# Altium schematic sheet Schematic.SchDoc
size A; SheetNumber: 1; SheetTotal: 1
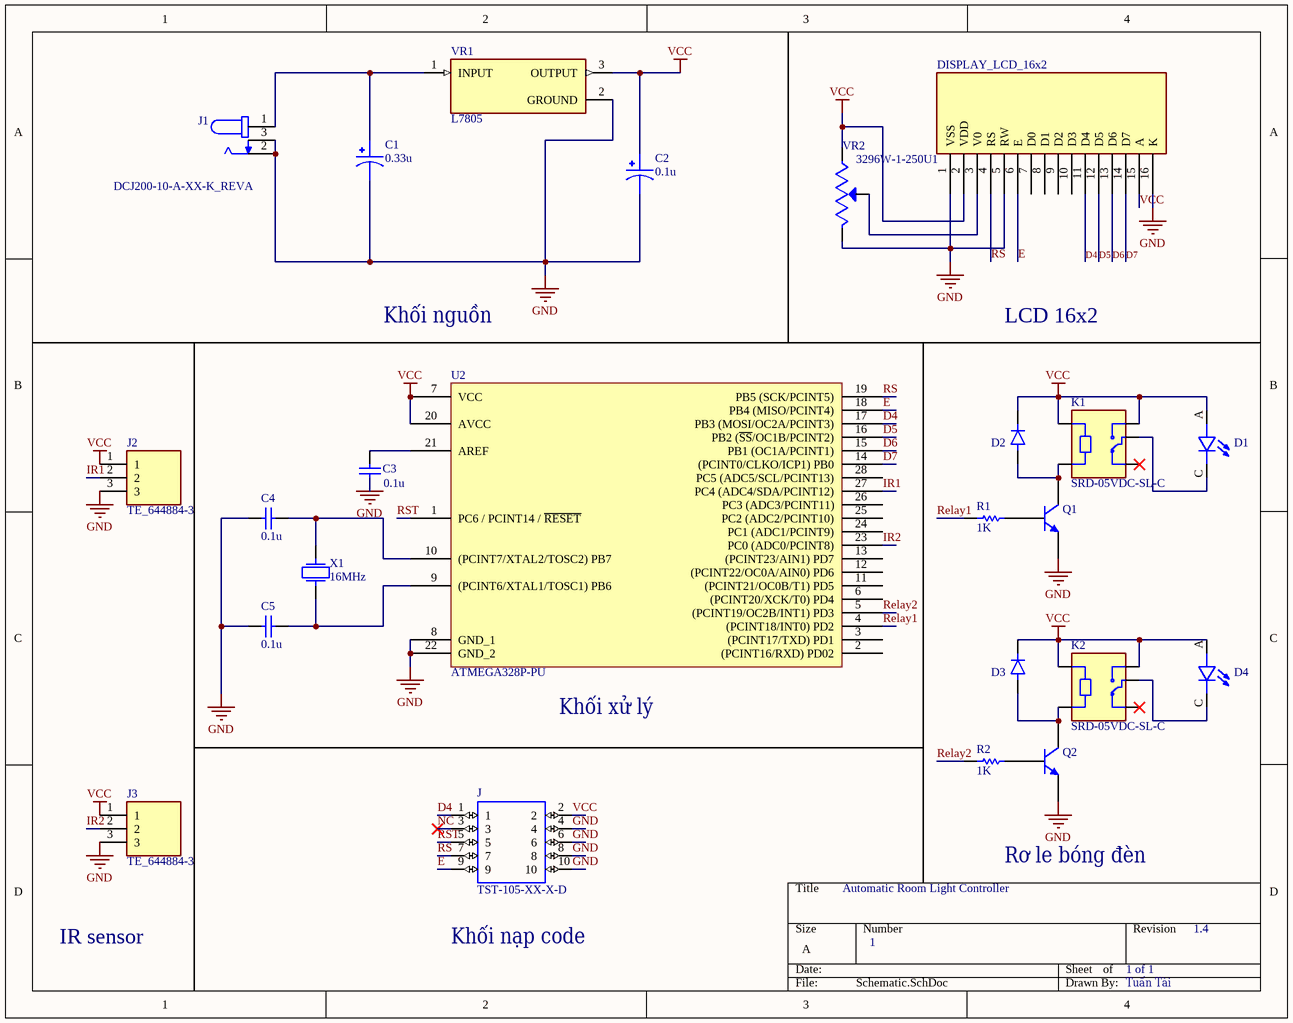
[diagram p0: Schematic.SchDoc]

## Parts
C1  0.33u  [CAPPRD500W60D1330H2700]
C2  0.1u  [CAPPRD500W60D1330H2700]
C3  value 0.1u  [CAPPRD500W60D1330H2700]  (hidden comment: Capacitor)
C4  value 0.1u  [CAPPRD500W60D1330H2700]  (hidden comment: Capacitor)
C5  value 0.1u  [CAPPRD500W60D1330H2700]  (hidden comment: Capacitor)
D1  L08R5000Q1  [LEDRD254W57D500H1070]  (value not drawn)
D2  1N4007-T  [DIOAD780W78L463D236]  (value not drawn)
D3  1N4007-T  [DIOAD780W78L463D236]  (value not drawn)
D4  L08R5000Q1  [LEDRD254W57D500H1070]  (value not drawn)
J  TST-105-XX-X-D  [TST-105-XX-X-D]
J1  DCJ200-10-A-XX-K_REVA  [GCT_DCJ200-10-A-XX-K_REVA]
J2  TE_644884-3  [TE_644884-3]
J3  TE_644884-3  [TE_644884-3]
K1  SRD-05VDC-SL-C  [RELAY_SRD-05VDC-SL-C]
K2  SRD-05VDC-SL-C  [RELAY_SRD-05VDC-SL-C]
Q1  Bipolar NPN 3 Pins Transistor VBIC Model  [TO92]  (value not drawn)
Q2  Bipolar NPN 3 Pins Transistor VBIC Model  [TO92]  (value not drawn)
R1  value 1K  [RESAD1100W55L680D260]  (hidden comment: Resistor)
R2  value 1K  [RESAD1100W55L680D260]  (hidden comment: Resistor)
U1  DISPLAY_LCD_16x2  [DISPLAY_LCD_16_2]
U2  ATMEGA328P-PU  [27_DIP_7.62mm]
VR1  L7805  [TO255P1020X450X2000-3]
VR2  3296W-1-250  [TRIM_3296W-1-250]
X1  F0: 16MHz  [XTAL_HC49P488W46L1150T500H350]  (hidden comment: Crystal)

## Nets
GND: C1.2 C2.2 C3.1 C4.1 C5.1 J.4 J.6 J.8 J.10 J1.2 J1.3 J2.3 J3.3 Q1.3(E) Q2.3(E) U1.1(VSS) U1.5(RW) U1.16(K) U2.8(GND_1) U2.22(GND_2) VR1.2(GROUND) VR2.3(CW)
VCC: C2.1 D1.A D2.K D3.K D4.A J.2 J2.1 J3.1 K1.A1 K1.NO K2.A1 K2.NO U1.2(VDD) U1.15(A) U2.7(VCC) U2.20(AVCC) VR1.3(OUTPUT) VR2.1(CCW)
D4: J.1 U1.11(D4) U2.17(PB3_(MOSI/OC2A/PCINT3))
D5: U1.12(D5) U2.16(PB2_(~{SS}/OC1B/PCINT2))
D6: U1.13(D6) U2.15(PB1_(OC1A/PCINT1))
D7: U1.14(D7) U2.14((PCINT0/CLKO/ICP1)_PB0)
E: J.9 U1.6(E) U2.18(PB4_(MISO/PCINT4))
IR1: J2.2 U2.27(PC4_(ADC4/SDA/PCINT12))
IR2: J3.2 U2.23(PC0_(ADC0/PCINT8))
NC: J.3
Relay1: R1.1 U2.4((PCINT18/INT0)_PD2)
Relay2: R2.1 U2.5((PCINT19/OC2B/INT1)_PD3)
RS: J.7 U1.4(RS) U2.19(PB5_(SCK/PCINT5))
RST: J.5 U2.1(PC6_/_PCINT14_/_~{RESET})
NetC1_1: C1.1 J1.1 VR1.1(INPUT)
NetC3_2: C3.2 U2.21(AREF)
NetC4_2: C4.2 U2.10((PCINT7/XTAL2/TOSC2)_PB7) X1.2
NetC5_2: C5.2 U2.9((PCINT6/XTAL1/TOSC1)_PB6) X1.1
NetD1_C: D1.C K1.COM
NetD2_A: D2.A K1.A2 Q1.1(C)
NetD3_A: D3.A K2.A2 Q2.1(C)
NetD4_C: D4.C K2.COM
NetQ1_2: Q1.2(B) R1.2
NetQ2_2: Q2.2(B) R2.2
NetU1_3: U1.3(V0) VR2.2(WIPER)

Not connected (* = marked no-connect by the designer): K1 NC*; K2 NC*; U1 7(D0) 8(D1) 9(D2) 10(D3); U2 2((PCINT16/RXD)_PD02) 3((PCINT17/TXD)_PD1) 6((PCINT20/XCK/T0)_PD4) 11((PCINT21/OC0B/T1)_PD5) 12((PCINT22/OC0A/AIN0)_PD6) 13((PCINT23/AIN1)_PD7) 24(PC1_(ADC1/PCINT9)) 25(PC2_(ADC2/PCINT10)) 26(PC3_(ADC3/PCINT11)) 28(PC5_(ADC5/SCL/PCINT13))

## Notes on the sheet
- Khối nguồn
- LCD 16x2
- (near U2) Khối xử lý
- Automatic Room Light Controller
- Rơ le bóng đèn
- IR sensor
- Khối nạp code
- 1
- 1 of 1
- 1.4
- Tuấn Tài

## Library data of the parts
C1 C2 = 478CKS010M: 4700ÂµF 10V Aluminum Electrolytic Capacitors Radial, Can 98.8mOhm @ 120Hz 2000 Hrs @ 85Â°C; MF: Illinois Capacitor; MP: 478CKS010M; SnapEDA_Link: https://www.snapeda.com/parts/478CKS010M/Illinois%20Capacitor/view-part/2347563/?ref=snap; Price: None; Mouser-Purchase-URL: https://snapeda.com/shop?store=Mouser&id=2347563; Availability: Warning; Package: Radial Illinois Capacitor; Value: *
C3-C5 = Capacitor: SimulationGenericComponent: True
D1 D4 = L08R5000Q1: LED, 5MM, ORANGE; LED / Lamp Size: 5mm / T-1 3/4; LED Colour: Orange; Typ Luminous Intensity: 4.3mcd; Viewing Angle: ...; MF: LED Technology; Value: *; SnapEDA_Link: https://www.snapeda.com/parts/L08R5000Q1/LED+Technology/view-part/?ref=snap; MP: L08R5000Q1; Check_prices: https://www.snapeda.com/parts/L08R5000Q1/LED+Technology/view-part/?ref=eda; Availability: In Stock; Price: None; Package: None
D2 D3 = 1N4007-T: Diode Standard 1A 1000V 1Vf DO41 | Diodes Inc 1N4007-T; MF: Diodes Incorporated; SnapEDA_Link: https://www.snapeda.com/parts/1N4007-T/Diodes+Inc./view-part/?ref=snap; Package: DO-41 Diodes Inc.; Value: *; MP: 1N4007-T; Check_prices: https://www.snapeda.com/parts/1N4007-T/Diodes+Inc./view-part/?ref=eda
J = TST-105-XX-X-D: Connector Header Through Hole 10 position 0.100 _2.54mm_; MF: Samtec; MP: TST-105-02-F-D; Value: *; SnapEDA_Link: https://www.snapeda.com/parts/TST-105-02-F-D/Samtec%20Inc./view-part/787167/?ref=snap; Package: None; Price: None; Availability: Unavailable
J1 = DCJ200-10-A-XX-K_REVA: Power Barrel Connector Jack 2.05mm ID (0.081), 5.50mm OD (0.217) Through Hole, Right Angle; MF: Global Connector Technology; MP: DCJ200-10-A-K1-K; SnapEDA_Link: https://www.snapeda.com/parts/DCJ200-10-A-K1-K/Global+Connector+Technology/view-part/?ref=snap; Package: None; Value: *; Check_prices: https://www.snapeda.com/parts/DCJ200-10-A-K1-K/Global+Connector+Technology/view-part/?ref=eda
J2 J3 = 644884-3: Package: None; Price: None; Value: *; MP: 644884-3; Availability: Unavailable
K1 K2 = SRD-05VDC-SL-C: 5V Trigger Relay Module For Arduino And Raspberry Pi 5V Trigger Relay Module For Arduino And Raspberry Pi; MF: Songle Relay; Check_prices: https://www.snapeda.com/parts/SRD-05VDC-SL-C/Songle+Relay/view-part/?ref=eda; Value: *; Availability: Not in stock; Price: None; Package: NON STANDARD-5 Songle Relay; MP: SRD-05VDC-SL-C; SnapEDA_Link: https://www.snapeda.com/parts/SRD-05VDC-SL-C/Songle+Relay/view-part/?ref=snap
Q1 Q2 = BJT NPN VBIC: SimulationGenericComponent: True; AFN: 1; AJC: -0.5; ART: 0.1; AVC1: 0; EA: 1.12; FC: 0.9; IBBE: 1e-06; IBCI: 1e-16; IBEI: 1e-18; MC: 0.33; NCN: 2; NKF: 0.5; PC: 0.75; TNOM: 27; VERS: 1.2; XII: 3; AJE: -0.5; AJS: -0.5; AVC2: 0; BFN: 1; CBCO: 0; CBEO: 0; CCSO: 0; CJC: 0; CJCP: 0; CJE: 0; CJEP: 0; CTH: 0; DEAR: 0; EAIC: 1.12; EAIE: 1.12; EAIS: 1.12; EANC: 1.12; EANE: 1.12; EANS: 1.12; EAP: 1.12; EBBE: 0; GAMM: 0; HRCF: 1; IBCIP: 0; IBCN: 0; IBCNP: 0; IBEIP: 0; IBEN: 0; IBENP: 0; IKF: 0; IKP: 0; IKR: 0; IS: 1e-16; ISP: 0; ISRR: 1; ITF: 0; KFN: 0; ME: 0.33; MS: 0.33; NBBE: 1; NCI: 1; NCIP: 1; NCNP: 2; NEI: 1; NEN: 2; NF: 1; NFP: 1; NR: 1; PE: 0.75; PS: 0.75; QBM: 0; QCO: 0; QTF: 0; RBI: 0.1; RBP: 0.1; RBX: 0; RCI: 0.1; RCX: 0; RE: 0; RS: 0; RTH: 0; TAVC: 0; TD: 0; TF: 0; TNBBE: 0; TNF: 0; TR: 0; TVBBE1: 0; TVBBE2: 0; VBBE: 0; VEF: 0; VER: 0; VO: 0; VREF: 0; VRT: 0; VTF: 0; WBE: 1; WSP: 1; XIKF: 0; XIN: 3; XIS: 3; XISR: 0; XRBI: 0; XRBP: 0; XRBX: 0; XRCI: 0; XRCX: 0; XRE: 0; XRS: 0; XTF: 0; XVO: 0
R1 R2 = Resistor: TC1: 0; SimulationGenericComponent: True; TC2: 0
U1 = DISPLAY_LCD_16_2: Display LCD 16x2 I2C.
U2 = ATMEGA328P-PU: ATMEGA328P-PU; 8 bit Microcontroller AVR 20MHz 1; 32kb Flash; 2kb RAM; I2C SPI 2; Manufacturer: Microchip / Atmel; Number of PWM Channels: 6; Number of Timers/Counters: 3; Min Supply Voltage: 1.8V; Max Supply Voltage: 5.5V; Interface: I2C,SPI,UART,USART,2-Wire; Number of I/Os: 23; Oscillator Type: Internal; Data Bus Width: 8b; Number of SPI Channels: 1; Watchdog Timer: Yes; Peripherals: Brown-out Detect/Reset,POR,PWM,WDT; Manufacturer Part Number: ATMEGA328P-PU; RoHS: Yes; Category: Microcontrollers; Stock 1: 5280; Pricing 1: 1=2,08000, 25=1,91000, 100=1,73000 (USD); Mount: Through Hole; Case/Package: PDIP; Number of Pins: 28; Contact Plating: Tin,Matte; Min Operating Temperature: -40°C; Max Operating Temperature: 85°C; Package Quantity: 14; Core Architecture: AVR; RAM Size: 2KB; Number of ADC Channels: 6; Packaging: Rail/Tube; Frequency: 20MHz; Number of Programmable I/O: 23; Max Frequency: 20MHz; Number of I2C Channels: 1; Memory Type: FLASH; Memory Size: 32KB; Length: 37.4mm; Height: 3.28mm; Width: 6.76mm; Radiation Hardening: No; REACH SVHC: No SVHC; Lead Free: Lead Free; ComponentLink1URL: https://datasheet.ciiva.com/20168/73-4283-20168380.pdf?src-supplier=Rapid+Electronics; ComponentLink1Description: https://datasheet.ciiva.com/20168/73-4283-20168380.pdf?src-supplier=Rapid+Electronics; ComponentLink2URL: https://datasheet.ciiva.com/19457/2139111-19457070.pdf?src-supplier=Jameco; ComponentLink2Description: https://datasheet.ciiva.com/19457/2139111-19457070.pdf?src-supplier=Jameco; ComponentLink3URL: https://datasheet.ciiva.com/1157/1684409-1157696.pdf?src-supplier=Element14; ComponentLink3Description: https://datasheet.ciiva.com/1157/1684409-1157696.pdf?src-supplier=Element14; ComponentLink4URL: https://datasheet.ciiva.com/26818/atmega328p-pu-26818578.pdf?src-supplier=IIIC; ComponentLink4Description: https://datasheet.ciiva.com/26818/atmega328p-pu-26818578.pdf?src-supplier=IIIC; ComponentLink5URL: https://datasheet.ciiva.com/29119/155197-da-01-en-microcontr-atmega328p-pu-8bit-pdip-28-29119593.pdf?src-supplier=Conrad; ComponentLink5Description: https://datasheet.ciiva.com/29119/155197-da-01-en-microcontr-atmega328p-pu-8bit-pdip-28-29119593.pdf?src-supplier=Conrad; ComponentLink6URL: https://datasheet.ciiva.com/15213/getdatasheetpartid-318533-15213133.pdf?src-supplier=Verical; ComponentLink6Description: https://datasheet.ciiva.com/15213/getdatasheetpartid-318533-15213133.pdf?src-supplier=Verical; Supplier 1: Digi-Key; Supplier Part Number 1: ATMEGA328P-PU-ND
VR1 = L7805: Standard Regulator Pos 5V 1.5A 3-Pin(3+Tab) TO-220FP Tube; MF: STMicroelectronics; MP: L7805; Value: *; SnapEDA_Link: https://www.snapeda.com/parts/L7805/STMicroelectronics/view-part/?ref=snap; Price: None; Package: None; Check_prices: https://www.snapeda.com/parts/L7805/STMicroelectronics/view-part/?ref=eda; Availability: Not in stock
VR2 = 3296W-1-250: 25 Ohms 0.5W, 1/2W PC Pins Through Hole Trimmer Potentiometer Cermet 25.0 Turn Top Adjustment; MF: Bourns; Purchase-URL: https://pricing.snapeda.com/search/part/3296W-1-250/?ref=eda; Check_prices: https://www.snapeda.com/parts/3296W-1-250/Bourns/view-part/?ref=eda; SnapEDA_Link: https://www.snapeda.com/parts/3296W-1-250/Bourns/view-part/?ref=snap; Price: None; Availability: In Stock; Package: NON STANDARD-3 Bourns; MP: 3296W-1-250; Value: *
X1 = Crystal: R: 500; Q: 50K; SimulationGenericComponent: True